# Altium schematic sheet 07)Power,JTAG,RESET.SchDoc
size 297 x 209 mm
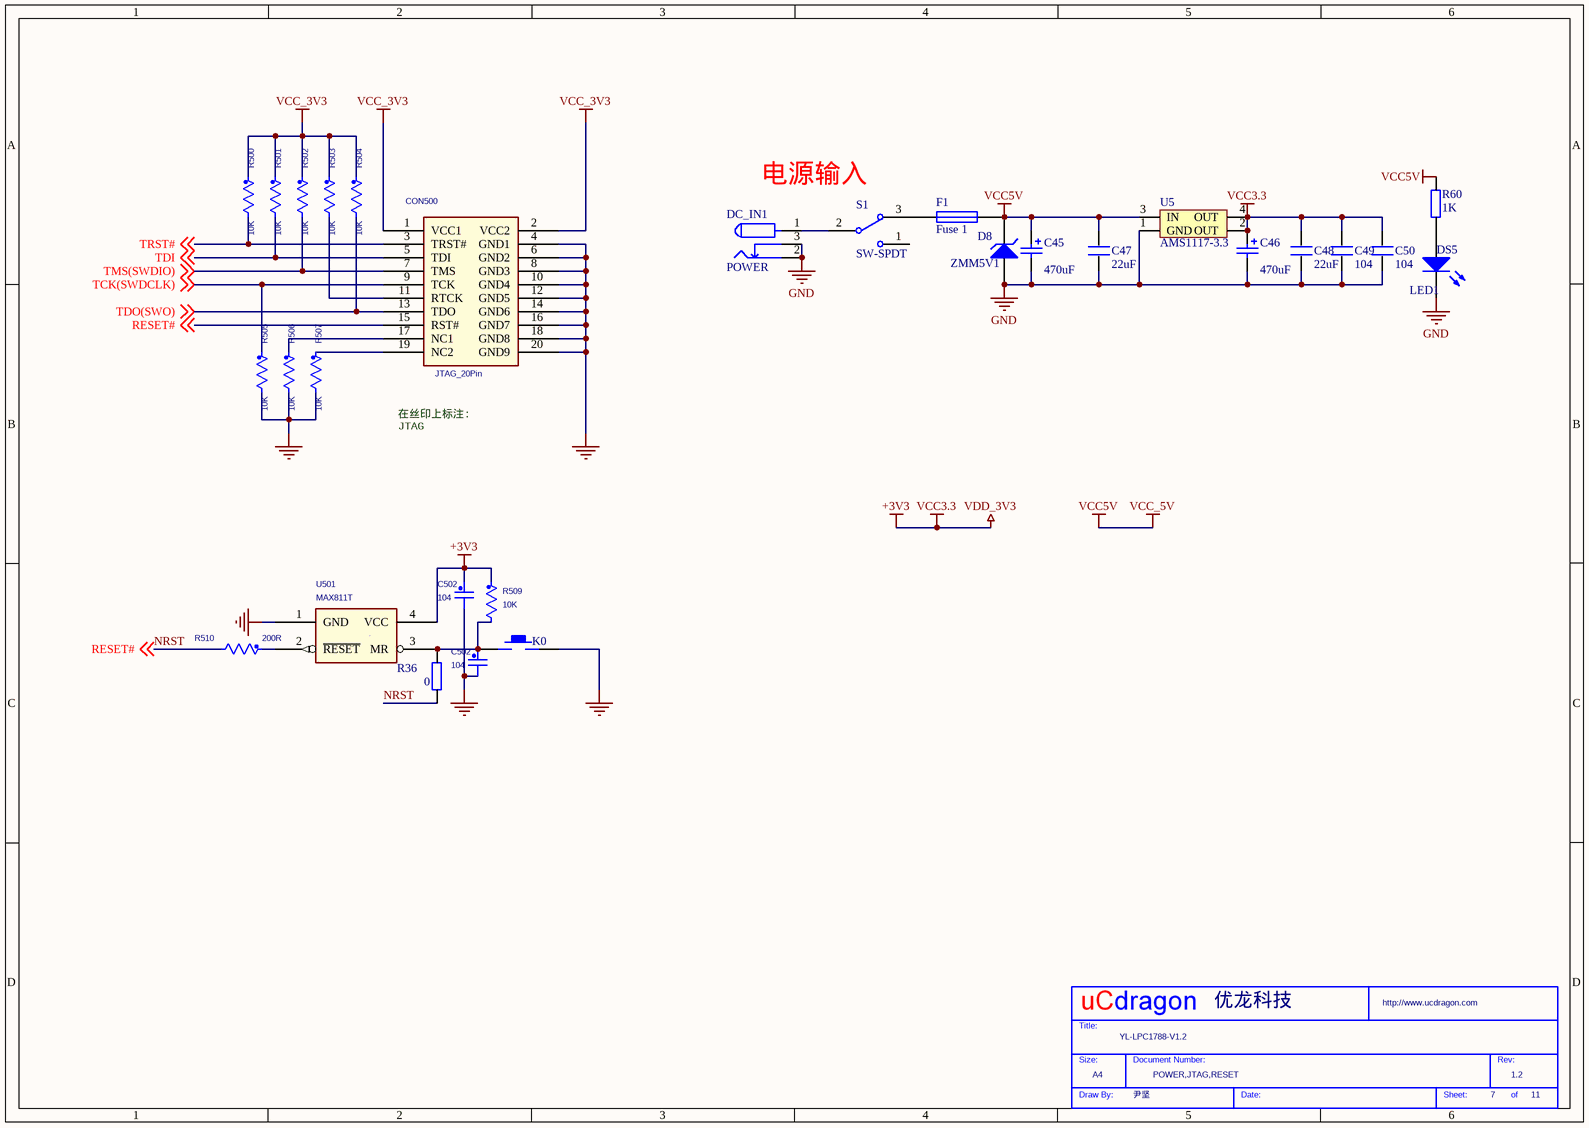
[diagram p0: 07)Power,JTAG,RESET.SchDoc]

## Parts
(Parts that share a designator on the sheet are numbered #1, #2 ... from top to bottom, then left to right.)
*  Page Count: 11  Page Number: 7  Page Size: A4  Title: YL-LPC1788-V1.2  RevCode: 1.2  Doc: POWER,JTAG,RESET  Drawing: 尹坚  Company: 优龙科技  (hidden comment: My Title 0)  (graphical)
C45  value 470uF  [7343]  (hidden comment: Cap Tantalum)
C46  value 470uF  [7343]  (hidden comment: Cap Tantalum)
C47  22uF  [0603P]
C48  22uF  [0603P]
C49  104  [0603P]
C50  104  [0603P]
C502#1  104  [0603P]
C502#2  104  [0603P]
CON500  JTAG_20Pin  [JTAG_20]
D8  ZMM5V1  [LL-34]
DC_IN1  POWER  [DC10B]
DS5  LED1  [SMDLED]
F1  Fuse 1  [0805]
K0  KEY_M  [K贴片]  (value not drawn)
R36  0  [0603P]
R60  1K  [0603P]
R500  10K  [0603P]
R501  10K  [0603P]
R502  10K  [0603P]
R503  10K  [0603P]
R504  10K  [0603P]
R505  10K  [0603P]
R506  10K  [0603P]
R507  10K  [0603P]
R509  10K  [0603P]
R510  200R  [0603P]
S1  SW-SPDT  [自锁开关6]
U5  AMS1117-3.3  [AMS1117]
U501  MAX811T  [SOT143]

## Nets
+3V3: C46.1 C48.2 C49.2 C50.2 C502#1.1 R509.1 U5.2(OUT) U5.4(OUT) U501.4(VCC)  [also labelled VCC3.3, VDD_3V3]
GND: C45.2 C46.2 C47.1 C48.1 C49.1 C50.1 D8.1(A) DC_IN1.2 DC_IN1.3 DS5.2(K) U5.1(GND)
GND_POWER: C502#1.2 C502#2.2 CON500.4(GND1) CON500.6(GND2) CON500.8(GND3) CON500.10(GND4) CON500.12(GND5) CON500.14(GND6) CON500.16(GND7) CON500.18(GND8) CON500.20(GND9) K0.2 R505.2 R506.2 R507.2 U501.1(GND)
VCC5V: C45.1 C47.2 D8.2(K) F1.2 R60.1 U5.3(IN)  [also labelled VCC_5V]
VCC_3V3: CON500.1(VCC1) CON500.2(VCC2) R500.1 R501.1 R502.1 R503.1 R504.1
NRST: CON500.15(RST#) R36.2 R510.2 ; off-sheet RESET#  [also labelled RESET#]
TCK(SWDCLK): CON500.9(TCK) R505.1 ; off-sheet TCK(SWDCLK)
TDI: CON500.5(TDI) R501.2 ; off-sheet TDI
TDO(SWO): CON500.13(TDO) R504.2 ; off-sheet TDO(SWO)
TMS(SWDIO): CON500.7(TMS) R502.2 ; off-sheet TMS(SWDIO)
TRST#: CON500.3(TRST#) R500.2 ; off-sheet TRST#
NetC502#2_1: C502#2.1 K0.1 R36.1 R509.2 U501.3(MR)
NetCON500_11: CON500.11(RTCK) R503.2
NetCON500_17: CON500.17(NC1) R506.1
NetCON500_19: CON500.19(NC2) R507.1
NetDC_IN1_1: DC_IN1.1 S1.2
NetDS5_1: DS5.1(A) R60.2
NetF1_1: F1.1 S1.3
NetR510_1: R510.1 U501.2(~{RESET})

Not connected (* = marked no-connect by the designer): S1 1

## Notes on the sheet
- 电源输入
- 在丝印上标注:
  JTAG
- (in symbol My Title 0) Title:; Size:; Document Number:; Rev:; Draw By:; Date:; Sheet:; of

## Library data of the parts
C45 C46 = Cap Tantalum: Polarized Capacitor (Surface Mount); Published: LatestRevisionDate; LatestRevisionDate: 2014-11-15; LatestRevisionNote: IPC-7351 Footprint Added.; PackageReference: C0805; Publisher: Am; PackageDescription: Chip Capacitor
C47-C50 = C_2
C502#1 C502#2 = C_Generic_Dup1: Dielectric: X7R; Mfg #1: KEMET; Voltage: 16V; P/N #1: C0603C104K4RAC; Toler.: 10%
D8 = D Zener: Zener Diode; Published: 8-Jun-2000; LatestRevisionDate: 17-Jul-2002; LatestRevisionNote: Re-released for DXP Platform.; PackageReference: DIODE-0.7; Publisher: Altium Limited
DC_IN1 = POW
DS5 = LED2: Typical RED, GREEN, YELLOW, AMBER GaAs LED; Published: 8-Jun-2000; LatestRevisionDate: 17-Jul-2002; LatestRevisionNote: Re-released for DXP Platform.; PackageDocument: Feb-2002; PackageReference: 3.2X1.6X1.1; Publisher: Altium Limited
F1 = Fuse 1: Fuse; Published: 8-Jun-2000; LatestRevisionDate: 17-Jul-2002; LatestRevisionNote: Re-released for DXP Platform.; PackageReference: PIN-W2/E2.8; Publisher: Altium Limited
R36 R60 = R
R500-R507 R509 R510 = R_Generic_Dup1: Toler.: 1%; Watts: 0.1W; P/N #1: CR10-1001F-T; Mfg #1: AVX
S1 = SW-SPDT: SPDT Subminiature Toggle Switch, Right Angle Mounting, Vertical Actuation; Published: 24-Mar-1999; LatestRevisionDate: 17-Dec-2003; LatestRevisionNote: Schematic revised, PCB Footprint replaced.; DatasheetVersion: 05-Dec-2000; PackageReference: TL36WW15050; Publisher: Altium Limited; ComponentLink1Description: Manufacturer Link; ComponentLink1URL: http://www.apem.com
U5 = AMS1117
U501 = UD215_1
* = My Title 0: Page Create Date: May 29, 2006; WebSite: http://www.ucdragon.com